# Altium schematic sheet PowerSupply.SchDoc: MSE - CSYEI : Power supply
size A4; Author: Guillaume Volery; SheetNumber: 3; SheetTotal: 8; SVN: OUI; Version: 2.1; NoProject: <no>; TitleProject: <project>
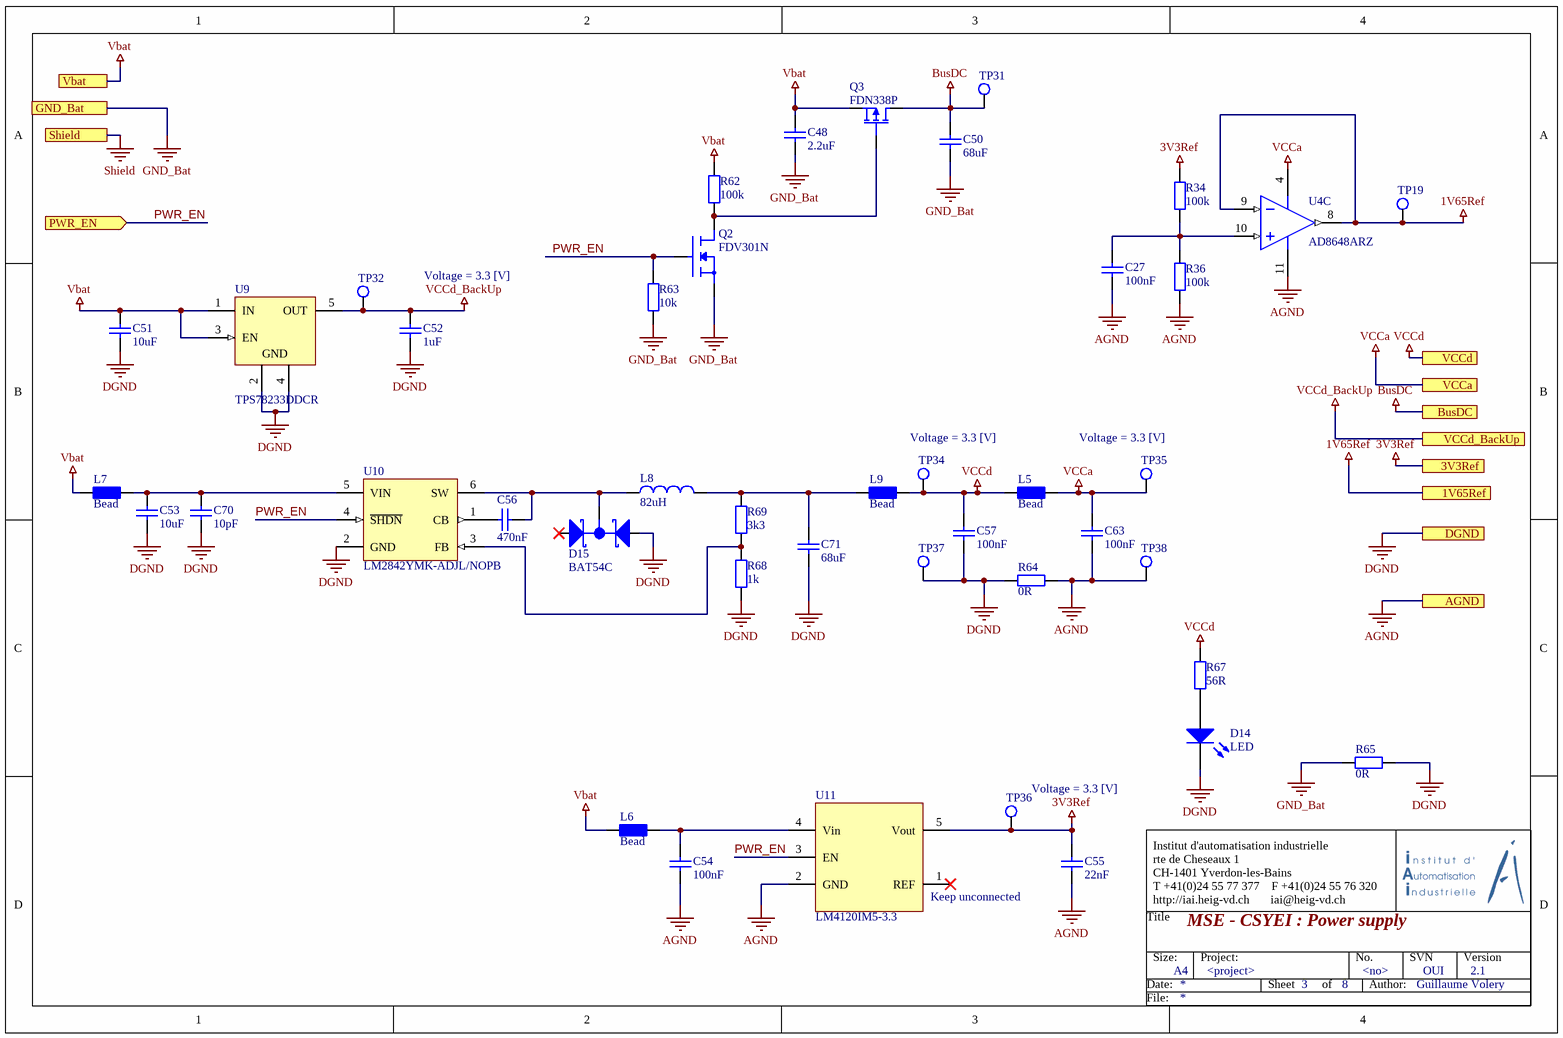
[diagram p0: PowerSupply.SchDoc]

## Parts
C27  100nF  [CAPC2012N]
C48  2.2uF  [CAPC2012N]
C50  68uF  [CAP1206]
C51  10uF  [CAP1206]
C52  1uF  [CAPC2012N]
C53  10uF  [CAP1206]
C54  100nF  [CAPC2012N]
C55  22nF  [CAPC2012N]
C56  470nF  [CAPC2012N]
C57  100nF  [CAPC2012N]
C63  100nF  [CAPC2012N]
C70  10pF  [CAPC2012N]
C71  68uF  [CAP1206]
D14  LED  [LED2012N]
D15  BAT54C  [SOT23-3N]
L5  Bead  [RESC2012N]
L6  Bead  [RESC2012N]
L7  Bead  [RESC2012N]
L8  82uH  [SRR1260A-820MC]
L9  Bead  [RESC2012N]
Q2  FDV301N  [SOT23-3N]
Q3  FDN338P  [SOT23-3N]
R34  100k  [RESC2012N]
R36  100k  [RESC2012N]
R62  100k  [RESC2012N]
R63  10k  [RESC2012N]
R64  0R  [RESC2012N]
R65  0R  [RESC2012N]
R67  56R  [RESC2012N]
R68  1k  [RESC2012N]
R69  3k3  [RESC2012N]
TP19  TP  [Testpoint]  (value not drawn)
TP31  TP  [Testpoint]  (value not drawn)
TP32  TP  [Testpoint]  (value not drawn)
TP34  TP  [Testpoint]  (value not drawn)
TP35  TP  [Testpoint]  (value not drawn)
TP36  TP  [Testpoint]  (value not drawn)
TP37  TP  [Testpoint]  (value not drawn)
TP38  TP  [Testpoint]  (value not drawn)
U4  AD8648ARZ  [ADI-R-14_M]  (part C of 4)
U9  TPS78233DDCR  [SOT-23-5]
U10  LM2842YMK-ADJL/NOPB  [SOT-23-6]
U11  LM4120IM5-3.3  [SOT-23-5]

## Ports
1V65Ref, 3V3Ref, AGND, BusDC, DGND, GND_Bat, PWR_EN (in), Shield, Vbat, VCCa, VCCd, VCCd_BackUp

## Nets
1V65Ref: TP19.1 U4.8(OUT_C) U4.9(-IN_C) ; port 1V65Ref
3V3Ref: C55.2 R34.2 TP36.1 U11.5(Vout) ; port 3V3Ref
AGND: C27.1 C54.1 C55.1 C63.1 R36.1 R64.2 TP38.1 U4.11(-V) U11.2(GND) ; port AGND
BusDC: C50.2 Q3.3(D) TP31.1 ; port BusDC
DGND: C51.1 C52.1 C53.1 C57.1 C70.1 C71.1 D14.2(K) D15.2(A2) R64.1 R65.2 R68.2 TP37.1 U9.2(GND) U9.4(GND) U10.2(GND) ; port DGND
GND_Bat: C48.1 C50.1 Q2.2(S) R63.1 R65.1 ; port GND_Bat
Shield: port Shield
Vbat: C48.2 C51.2 L6.1 L7.1 Q3.2(S) R62.2 U9.1(IN) U9.3(EN) ; port Vbat
VCCa: C63.2 L5.2 TP35.1 U4.4(+V) ; port VCCa
VCCd: C57.2 L5.1 L9.2 R67.2 TP34.1 ; port VCCd
VCCd_BackUp: C52.2 TP32.1 U9.5(OUT) ; port VCCd_BackUp
PWR_EN: Q2.1(G) R63.2 U10.4(~{SHDN}) U11.3(EN) ; port PWR_EN
NetC27_2: C27.2 R34.1 R36.2 U4.10(+IN_C)
NetC53_2: C53.2 C70.2 L7.2 U10.5(VIN)
NetC54_2: C54.2 L6.2 U11.4(Vin)
NetC56_1: C56.1 U10.1(CB)
NetC56_2: C56.2 D15.3(K) L8.1 U10.6(SW)
NetC71_2: C71.2 L8.2 L9.1 R69.2
NetD14_1: D14.1(A) R67.1
NetQ2_3: Q2.3(D) Q3.1(G) R62.1
NetR68_1: R68.1 R69.1 U10.3(FB)

Not connected (* = marked no-connect by the designer): D15 1(A1)*; U11 1(REF)*

## Notes on the sheet
- Voltage = 3.3 [V]
- (near TP35) Voltage = 3.3 [V]
- (near TP36) Voltage = 3.3 [V]
- (near U11) Keep unconnected
- Title
- Institut d'automatisation industrielle
  rte de Cheseaux 1
  CH-1401 Yverdon-les-Bains
  T +41(0)24 55 77 377    F +41(0)24 55 76 320
  http://iai.heig-vd.ch       iai@heig-vd.ch
- Date:
- Size:
- A4
- Project:
- Sheet
- of
- No.
- Author:
- SVN
- Version
- File:

## Library data of the parts
C27 C54 C57 C63 = Cap_100nF: Capacitor; Value: 100nF; Supplier 1: Digi-Key; Supplier Part Number 1: 478-1395-1-ND
C48 = Cap_2.2uF: Capacitor; Value: 2.2uF; Supplier 1: Digi-Key; Supplier Part Number 1: 490-10744-1-ND
C50 C71 = Cap_68uF: Capacitor; Value: 68uF; Supplier 1: Digi-Key; Supplier Part Number 1: 445-11687-1-ND
C51 C53 = Cap_10uF: Capacitor; Value: 10uF; Supplier 1: Digi-Key; Supplier Part Number 1: 445-7886-1-ND
C52 = Cap_1uF: Capacitor; Value: 1uF; Supplier 1: Digi-Key; Supplier Part Number 1: 490-10743-1-ND
C55 = Cap_22nF: Capacitor; Value: 22nF; Supplier 1: Digi-Key; Supplier Part Number 1: 311-1138-1-ND
C56 = Cap_470nF: Capacitor; Value: 470nF; Supplier 1: Digi-Key; Supplier Part Number 1: 399-8100-1-ND
C70 = Cap_10pF: Capacitor; Value: 10pF; Supplier 1: Digi-Key; Supplier Part Number 1: 311-1099-1-ND
D14 = LED_Green_0805: Supplier 1: Digi-Key; Supplier Part Number 1: 475-1410-1-ND
L8 = SRR1260A-820M: Value: 82uH; Supplier 1: Digi-Key; Supplier Part Number 1: SRR1260A-820MCT-ND
Q3 = FDN338P: MOSFet P; Supplier 1: Digi-Key; Supplier Part Number 1: FDN338PCT-ND; Value: FDN338P
R34 R36 R62 = Res_100k: Resistor; Value: 100k; Supplier 1: Digi-Key; Supplier Part Number 1: 311-100KCRCT-ND
R63 = Res_10k: Resistor; Value: 10k; Supplier 1: Digi-Key; Supplier Part Number 1: 311-10.0KCRCT-ND
R64 R65 = Res_0R: Resistor; Value: 0R; Supplier 1: Digi-Key; Supplier Part Number 1: 311-0.0ARCT-ND
R67 = Res_56R: Resistor; Value: 56R; Supplier 1: Digi-Key; Supplier Part Number 1: 311-56.0CRCT-ND
R68 = Res_1k: Resistor; Value: 1k; Supplier 1: Digi-Key; Supplier Part Number 1: 311-1.00KCRCT-ND
R69 = Res_3k3: Resistor; Value: 3k3; Supplier 1: Digi-Key; Supplier Part Number 1: 311-3.30KCRCT-ND
TP19 TP31 TP32 TP34-TP38 = TP: =Value; Supplier 1: Digi-Key; Supplier Part Number 1: 36-5006-ND
U4 = AD8648ARZ: Quad Channel Wide Bandwidth Operational Amplifier, 22 MHz BW, 12 V/us SR, Industrial, 14-pin SOIC (R-14), Tube; Generic Part Number: AD8648; Manufacturer: Analog Devices; Amplifiers Per Package: 4; Automotive Qualified: Yes; Input Bias Current: 200fA; Input Offset Voltage: 700uV; Iq/Amp: 2mA; Slew Rate: 12V/us; Small Signal Bandwidth: 22MHz; V Span Max: 5.5V; V Span Min: 2.7V; DatasheetVersion: Rev. D; PackageVersion: 060606-A; PackageReference: R-14; PackageDescription: 14-Pin Standard Small Outline Package, Body 8.65 x 3.9 mm, Pitch 1.27 mm; Mounting Technology: Surface Mount; Code_JEDEC: MS-012-AB; PartNumber: AD8648ARZ; ComponentLink1Description: Manufacturer URL; ComponentLink1URL: http://www.analog.com/en/index.html; ComponentLink2Description: Datasheet; ComponentLink2URL: http://www.analog.com/static/imported-files/data_sheets/AD8646_8647_8648.pdf; ComponentLink3Description: Package Specification; ComponentLink3URL: http://www.analog.com/static/imported-files/packages/PKG_PDF/SOIC_Narrow%20(R)/R_14.pdf; Supplier 1: Digi-Key; Supplier Part Number 1: AD8648ARZ-ND
U9 = TPS78233DDCR: Single Output LDO, 150 mA, Fixed 3.3 V Output, 2.2 to 5.5 V Input, with 0.5 uA Quiescent Current, 5-pin SOT (DDC), -40 to 125 degC, Green (RoHS & no Sb/Br); Manufacturer: Texas Instruments; Accuracy(%): 3; Dynamic Voltage Scaling: TRUE; Fixed Output Options(V): 3.3; Iout(Max)(A): 0.15; Iq(Typ)(mA): 0.0005; Rating: Catalog; SubFamily: Single Channel LDO; Vdo(Typ)(mV): 130; Vin(Max)(V): 5.5; Vin(Min)(V): 2.2; DatasheetVersion: SBVS115B; PackageVersion: 4204403-2/E; PackageReference: DDC5; PackageDescription: 5-Pin Plastic Small Outline, Body 2.9 x 1.6 mm, 0.95 mm Pitch; Supplier 1: Digi-Key; Supplier Part Number 1: 296-24059-1-ND; Eco-Plan: Green (RoHS & no Sb/Br); Vout Adj(Max)(V): 3.3; Vout Adj(Min)(V): 3.3; Mounting Technology: Surface Mount; Code_JEDEC: MO-193; PartNumber: TPS78233DDCR; ComponentLink1Description: Manufacturer URL; ComponentLink1URL: http://www.ti.com/; ComponentLink2Description: Datasheet; ComponentLink2URL: http://www.ti.com/general/docs/lit/getliterature.tsp?genericPartNumber=TPS78233&fileType=pdf; ComponentLink3Description: Package Specification; ComponentLink3URL: http://www.ti.com/litv/pdf/mpds123d
U10 = LM2842YMK-ADJL/NOPB: 600 mA up to 42V Input Step-Down DC/DC Regulator, Thin 6-pin SOT23, Pb-Free, 1000 Reel; Supplier 1: Digi-Key; Supplier Part Number 1: LM2842YMK-ADJL/NOPBCT-ND
D15 = BAT54C: Supplier 1: Digi-Key; Supplier Part Number 1: BAT54CLT1GOSCT-ND
L5-L7 L9 = Bead: Value: Bead; Supplier 1: Digi-Key; Supplier Part Number 1: 240-2399-1-ND
Q2 = FDV301N: Value: FDV301N; Supplier 1: Digi-Key; Supplier Part Number 1: FDV301NCT-ND
U11 = LM4120IM5-3.3: Supplier 1: Digi-Key; Supplier Part Number 1: LM4120IM5-3.3/NOPBCT-ND